# Altium project Droon_REV3.PrjPCB
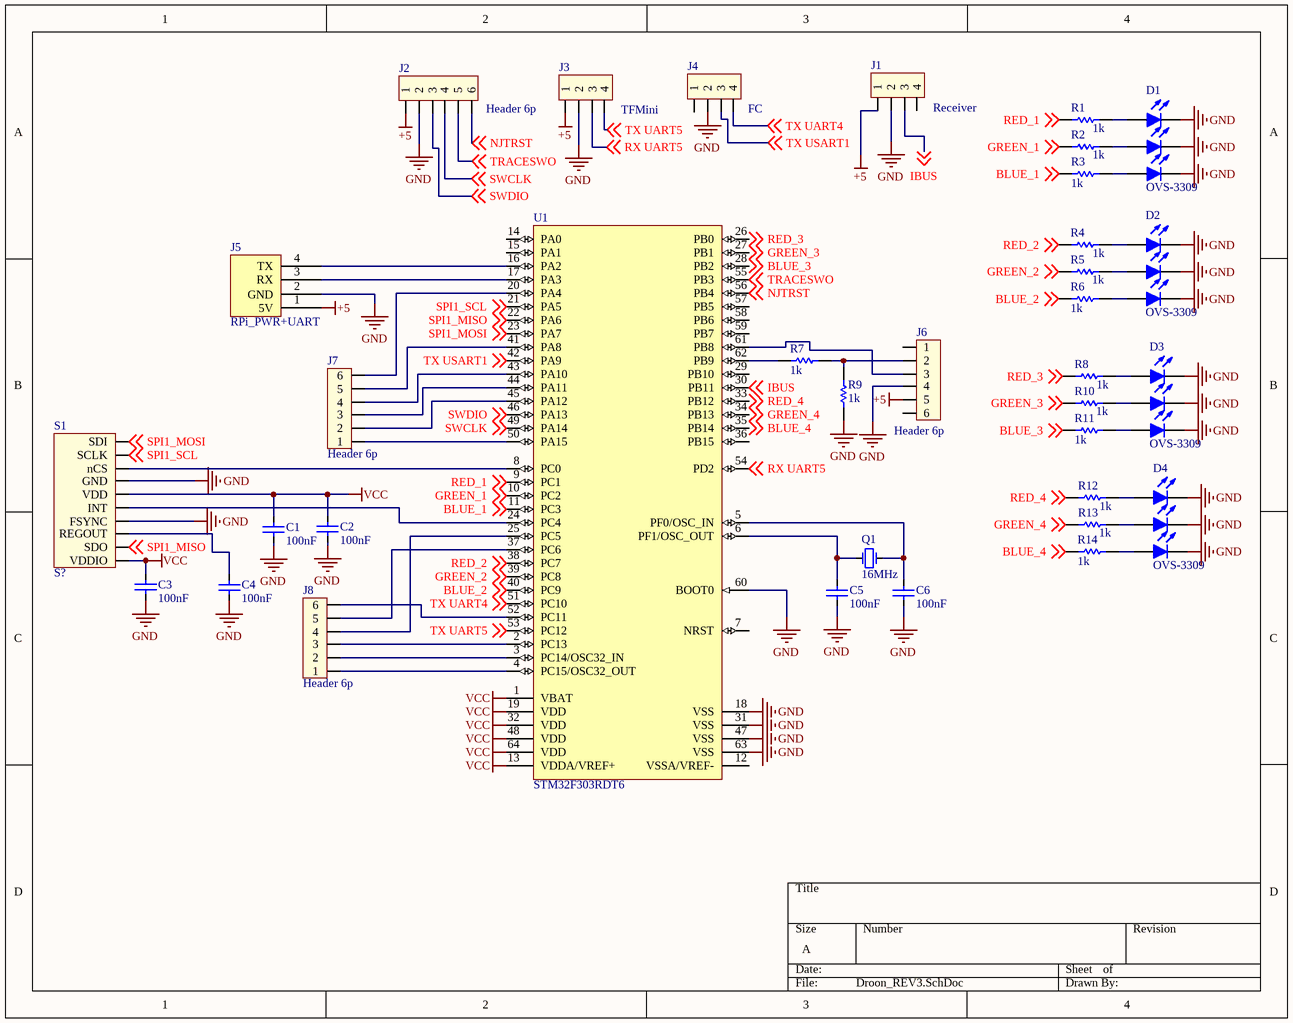
[diagram p0: Droon_REV3.SchDoc]
3 sheets, 52 parts. Net scope: global (net labels, ports and power ports of the same name join across sheets).
Board file: FC_PiHat_REV1.PcbDoc
Sheets:
  Droon_REV3.SchDoc
  Power 5V.SchDoc
  Power 3V3.SchDoc

## Sheet Droon_REV3.SchDoc
size A

### Parts
C1  100nF  [C0603]
C2  100nF  [C0603]
C3  100nF  [C0603]
C4  100nF  [C0603]
C5  100nF  [C0603]
C6  100nF  [C0603]
D1  OVS-3309  [LED RGB]
D2  OVS-3309  [LED RGB]
D3  OVS-3309  [LED RGB]
D4  OVS-3309  [LED RGB]
J1  Receiver  [JST-SH 4pin 1mm pitch]
J2  Header 6p  [JST-SH 6pin 1mm pitch]
J3  TFMini  [JST-SH 4pin 1mm pitch]
J4  FC  [JST-SH 4pin 1mm pitch]
J5  RPi_PWR+UART  [Header 2x20 2.54mm]
J6  Header 6p  [HEADER 6x1 2.54]
J7  Header 6p  [JST-SH 6pin 1mm pitch]
J8  Header 6p  [JST-SH 6pin 1mm pitch]
Q1  16MHz  [Clock 2012"(5032)]
R1  1k  [R 0603]
R2  1k  [R 0603]
R3  1k  [R 0603]
R4  1k  [R 0603]
R5  1k  [R 0603]
R6  1k  [R 0603]
R7  1k  [R 0603]
R8  1k  [R 0603]
R9  1k  [R 0603]
R10  1k  [R 0603]
R11  1k  [R 0603]
R12  1k  [R 0603]
R13  1k  [R 0603]
R14  1k  [R 0603]
S1  S?  [IMU-ICM-20689]
U1  STM32F303RDT6  [LQFP64-STM32F303]

### Nets
+5: J1.1 J2.1 J3.1 J5.1(5V) J6.5
GND: C1.1 C2.1 C3.1 C4.1 C5.1 C6.1 D1.BK D1.GK D1.RK D2.BK D2.GK D2.RK D3.BK D3.GK D3.RK D4.BK D4.GK D4.RK J1.2 J2.2 J3.2 J4.2 J5.2(GND) J6.4 R9.1 S1.11(FSYNC) S1.18(GND) U1.18(VSS) U1.31(VSS) U1.47(VSS) U1.60(BOOT0) U1.63(VSS)
VCC: C1.2 C2.2 C3.2 S1.8(VDDIO) S1.13(VDD) U1.1(VBAT) U1.13(VDDA/VREF+) U1.19(VDD) U1.32(VDD) U1.48(VDD) U1.64(VDD)
BLUE_1: R3.1 U1.11(PC3) ; off-sheet BLUE_1
BLUE_2: R6.1 U1.40(PC9) ; off-sheet BLUE_2
BLUE_3: R11.1 U1.28(PB2) ; off-sheet BLUE_3
BLUE_4: R14.1 U1.35(PB14) ; off-sheet BLUE_4
GREEN_1: R2.1 U1.10(PC2) ; off-sheet GREEN_1
GREEN_2: R5.1 U1.39(PC8) ; off-sheet GREEN_2
GREEN_3: R10.1 U1.27(PB1) ; off-sheet GREEN_3
GREEN_4: R13.1 U1.34(PB13) ; off-sheet GREEN_4
IBUS: J1.3 U1.30(PB11) ; off-sheet IBUS
NJTRST: J2.6 U1.56(PB4) ; off-sheet NJTRST
RED_1: R1.1 U1.9(PC1) ; off-sheet RED_1
RED_2: R4.1 U1.38(PC7) ; off-sheet RED_2
RED_3: R8.1 U1.26(PB0) ; off-sheet RED_3
RED_4: R12.1 U1.33(PB12) ; off-sheet RED_4
RX UART5: J3.3 U1.54(PD2) ; off-sheet RX UART5
SPI1_MISO: S1.9(SDO) U1.22(PA6) ; off-sheet SPI1_MISO
SPI1_MOSI: S1.24(SDI) U1.23(PA7) ; off-sheet SPI1_MOSI
SPI1_SCL: S1.23(SCLK) U1.21(PA5) ; off-sheet SPI1_SCL
SWCLK: J2.4 U1.49(PA14) ; off-sheet SWCLK
SWDIO: J2.3 U1.46(PA13) ; off-sheet SWDIO
TRACESWO: J2.5 U1.55(PB3) ; off-sheet TRACESWO
TX UART4: J4.4 U1.51(PC10) ; off-sheet TX UART4
TX UART5: J3.4 U1.53(PC12) ; off-sheet TX UART5
TX USART1: J4.3 U1.42(PA9) ; off-sheet TX USART1
NetC4_2: C4.2 S1.10(REGOUT)
NetC5_2: C5.2 Q1.1(OSC1) U1.6(PF1/OSC_OUT)
NetC6_2: C6.2 Q1.2(OSC2) U1.5(PF0/OSC_IN)
NetD1_BA: D1.BA R3.2
NetD1_GA: D1.GA R2.2
NetD1_RA: D1.RA R1.2
NetD2_BA: D2.BA R6.2
NetD2_GA: D2.GA R5.2
NetD2_RA: D2.RA R4.2
NetD3_BA: D3.BA R11.2
NetD3_GA: D3.GA R10.2
NetD3_RA: D3.RA R8.2
NetD4_BA: D4.BA R14.2
NetD4_GA: D4.GA R13.2
NetD4_RA: D4.RA R12.2
NetJ5_3: J5.3(RX) U1.17(PA3)
NetJ5_4: J5.4(TX) U1.16(PA2)
NetJ6_2: J6.2 R7.2 R9.2
NetJ6_3: J6.3 U1.61(PB8)
NetJ7_1: J7.1(6) U1.20(PA4)
NetJ7_2: J7.2(5) U1.41(PA8)
NetJ7_3: J7.3(4) U1.43(PA10)
NetJ7_4: J7.4(3) U1.44(PA11)
NetJ7_5: J7.5(2) U1.45(PA12)
NetJ7_6: J7.6(1) U1.50(PA15)
NetJ8_1: J8.1 U1.4(PC15/OSC32_OUT)
NetJ8_2: J8.2 U1.3(PC14/OSC32_IN)
NetJ8_3: J8.3 U1.2(PC13)
NetJ8_4: J8.4 U1.25(PC5)
NetJ8_5: J8.5 U1.37(PC6)
NetJ8_6: J8.6 U1.52(PC11)
NetR7_1: R7.1 U1.62(PB9)
NetS1_12: S1.12(INT) U1.24(PC4)
NetS1_22: S1.22(nCS) U1.8(PC0)

Not connected (* = marked no-connect by the designer): J1 4; J4 1; J6 1 6; U1 7(NRST) 12(VSSA/VREF-) 14(PA0) 15(PA1) 29(PB10) 36(PB15) 57(PB5) 58(PB6) 59(PB7)

### Library data of the parts
C1-C6 = Capacitor: Capacitor Ceramic; Value: 100nF
D1-D4 = LED Tripple: LED RGB; FarnellPN: 1716792; ManufacturerPN: OVS-3309
J1 J3 J4 = Header 4p
Q1 = Crystal: Quarz crystal; Value: 16MHz
R1-R14 = Res: Resistor; Value: 1k
S1 = IMU_ICM-20689
U1 = LQFP64-STM32F303: ARM Cortex-M4 32-bit MCU, 384 KB Flash, 80 KB Internal RAM, 51 I/Os, 64-Pin LQFP, -40 to 85 degC, Tray
J2 J6-J8 = Header 6p: ManufacturerPN: *; FarnellPN: *

## Sheet Power 5V.SchDoc
size A
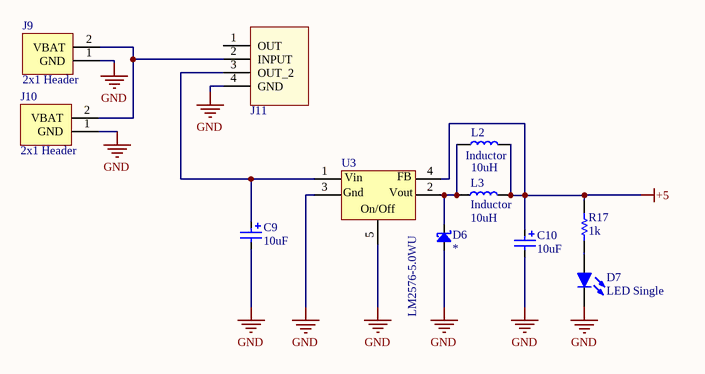
[diagram p1: Power 5V.SchDoc]

### Parts
C9  10uF  [Capacitor Through Hole 5x11]
C10  10uF  [Through hole Capacitor 16V 470uF]
D6  *  [Schottky Rectifier diode]
D7  LED Single  [LED 0603]
J9  2x1 Header  [Header 1x2 2.54mm]
J10  2x1 Header  [Header 1x2 2.54mm]
J11  Power Switch  [POWER SWITCH]  (value not drawn)
L2  Inductor  value 10uH  [Inductor 12.5x12.5x6mm]
L3  Inductor  value 10uH  [Inductor 12.5x12.5x6mm]
R17  1k  [R 0603]
U3  LM2576-5.0WU  [5V 3A REG]

### Nets
+5: C10.1 L2.2 L3.2 R17.1 U3.4
GND: C9.2 C10.2 D6.2(A) D7.2(K) J9.1(GND) J10.1(GND) J11.4(GND) U3.3 U3.5
NetC9_1: C9.1 J11.3(OUT_2) U3.1
NetD6_1: D6.1(K) L2.1 L3.1 U3.2
NetD7_1: D7.1(A) R17.2
NetJ9_2: J9.2(VBAT) J10.2(VBAT) J11.2(INPUT)

Not connected (* = marked no-connect by the designer): J11 1(OUT)

### Notes on the sheet
- (in symbol LM2576-5.0WU) Vin; FB; Gnd; Vout; On/Off

### Library data of the parts
C9 C10 = Capacitor Polarized: Capacitor; Value: 10uF
D6 = Diode Schottky: ManufacturerPN: *; FarnellPN: *
D7 = LED Single: LED
J9 J10 = 2x1 Header (power)
R17 = Res: Resistor; Value: 1k
U3 = LM2576-5.0WU: IC REG BUCK 5V 3A TO263-5; Manufacturer: Microchip Micrel; Number of Outputs: 1; Max Input Voltage: 40V; Min Input Voltage: 4V; Switching Frequency: 52kHz; Synchronous Rectifier: No; Output Type: Fixed; Output Configuration: Positive; Efficiency: 82%; Supplier 1: Farnell; Manufacturer Part Number: LM2576-5.0WU; Stock 1: 0; Mount: Surface Mount; Case/Package: TO-263; Number of Pins: 5; Min Operating Temperature: -40°C; Max Operating Temperature: 85°C; Packaging: Bulk; Output Current: 3A; Output Voltage: 5V; Package Quantity: 50; Nominal Output Voltage: 5V; Min Output Voltage: 5V; Max Output Current: 3A; Length: 10.67mm; Height: 4.59mm; Width: 9.17mm; Radiation Hardening: No; REACH SVHC: No SVHC; Lead Free: Lead Free; ComponentLink1URL: http://components.arrow.com/part/dataview/41722529S2342416N1374?src-supplier=Arrow; ComponentLink1Description: http://components.arrow.com/part/dataview/41722529S2342416N1374?src-supplier=Arrow; ComponentLink2URL: http://www.micrel.com/_PDF/lm2576.pdf?src-supplier=Future+Electronics; ComponentLink2Description: http://www.micrel.com/_PDF/lm2576.pdf?src-supplier=Future+Electronics; ComponentLink3URL: http://www.microchip.com/mymicrochip/filehandler.aspx?ddocname=en579007&src-supplier=Digi-Key; ComponentLink3Description: http://www.microchip.com/mymicrochip/filehandler.aspx?ddocname=en579007&src-supplier=Digi-Key; ComponentLink4URL: https://www.verical.com/server-webapp/html/getDatasheet?partID=716600&src-supplier=Verical; ComponentLink4Description: https://www.verical.com/server-webapp/html/getDatasheet?partID=716600&src-supplier=Verical; Supplier Part Number 1: 2100269
J11 = Power Switch: Supplier 1: Farnell

## Sheet Power 3V3.SchDoc
size A
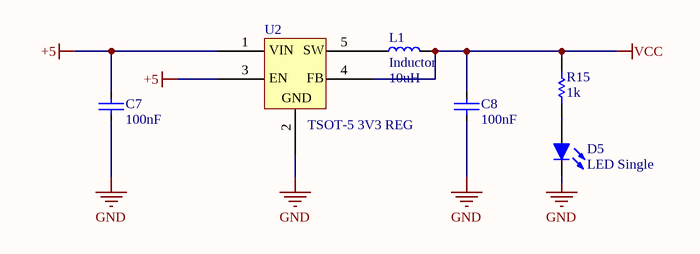
[diagram p2: Power 3V3.SchDoc]

### Parts
C7  100nF  [C0603]
C8  100nF  [C0603]
D5  LED Single  [LED 0603]
L1  Inductor  value 10uH  [C1206]
R15  1k  [R 0603]
U2  TSOT-5 3V3 REG  [SOT-5 3V3 REG]

### Nets
+5: C7.2 U2.1 U2.3
GND: C7.1 C8.1 D5.2(K) U2.2
VCC: C8.2 L1.2 R15.2 U2.4
NetD5_1: D5.1(A) R15.1
NetL1_1: L1.1 U2.5

### Notes on the sheet
- (in symbol TSOT-5 3V3 REG) VIN; SW; EN; FB; GND

### Library data of the parts
C7 C8 = Capacitor: Capacitor Ceramic; Value: 100nF
D5 = LED Single: LED
R15 = Res: Resistor; Value: 1k
U2 = TSOT-5 3V3 REG: ANALOG DEVICES         ADP2108AUJZ-3.3-R7            STEP-DOWN DC/DC CONVERTER, TSOT-5; Output Voltage: 3.3V; Max Output Current: 600mA; Number of Outputs: 1; Max Input Voltage: 5.5V; Min Input Voltage: 2.3V; Efficiency: 95%; Switching Frequency: 3MHz; Synchronous Rectifier: Yes; Operating Supply Current: 30uA; Polarity: Positive; Quiescent Current: 18uA; Accuracy: 2%; Output Type: Fixed; Supplier 1: Farnell; Manufacturer: Analog Devices; Manufacturer Part Number: ADP2108AUJZ-3.3-R7; Stock 1: 5315; Pricing 1: 1=1.61, 25=1.25, 50=1.2, 100=1.15, 250=1.03, 500=0.892, 1000=0.845, 2500=0.798 (EUR); Mount: Surface Mount; Case/Package: TSOT; Number of Pins: 5; Min Operating Temperature: -40°C; Max Operating Temperature: 125°C; Output Current: 600mA; Packaging: Tape and Reel; Nominal Output Voltage: 3.3V; Min Output Voltage: 3.3V; Output Configuration: Positive; Length: 2.9mm; Height: 0.9mm; Width: 1.6mm; Radiation Hardening: No; REACH SVHC: No SVHC; Lead Free: Contains Lead; ComponentLink1URL: http://uk.rs-online.com/webdocs/14ba/0900766b814bac03.pdf?src-supplier=RSComponents; ComponentLink1Description: http://uk.rs-online.com/webdocs/14ba/0900766b814bac03.pdf?src-supplier=RSComponents; ComponentLink2URL: http://www.farnell.com/datasheets/1838518.pdf?src-supplier=Element14; ComponentLink2Description: http://www.farnell.com/datasheets/1838518.pdf?src-supplier=Element14; ComponentLink3URL: http://www.analog.com/static/imported-files/data_sheets/ADP2108.pdf?src-supplier=Avnet; ComponentLink3Description: http://www.analog.com/static/imported-files/data_sheets/ADP2108.pdf?src-supplier=Avnet; ComponentLink4URL: http://www.farnell.com/datasheets/1537430.pdf?src-supplier=Farnell; ComponentLink4Description: http://www.farnell.com/datasheets/1537430.pdf?src-supplier=Farnell; ComponentLink5URL: https://www.analog.com/media/en/technical-documentation/data-sheets/ADP2108.pdf?src-supplier=Digi-Key; ComponentLink5Description: https://www.analog.com/media/en/technical-documentation/data-sheets/ADP2108.pdf?src-supplier=Digi-Key; ComponentLink6URL: http://www.analog.com/media/en/technical-documentation/data-sheets/ADP2108.pdf?src-supplier=Digi-Key; ComponentLink6Description: http://www.analog.com/media/en/technical-documentation/data-sheets/ADP2108.pdf?src-supplier=Digi-Key; Supplier Part Number 1: 2112606

## Nets that join several sheets
+5: Droon_REV3 (5 pins), Power 5V (5 pins), Power 3V3 (C7.2 U2.1 U2.3)
GND: Droon_REV3 (32 pins), Power 5V (9 pins), Power 3V3 (C7.1 C8.1 D5.2 U2.2)
VCC: Droon_REV3 (11 pins), Power 3V3 (C8.2 L1.2 R15.2 U2.4)